# Altium project phancung1.PrjPcb
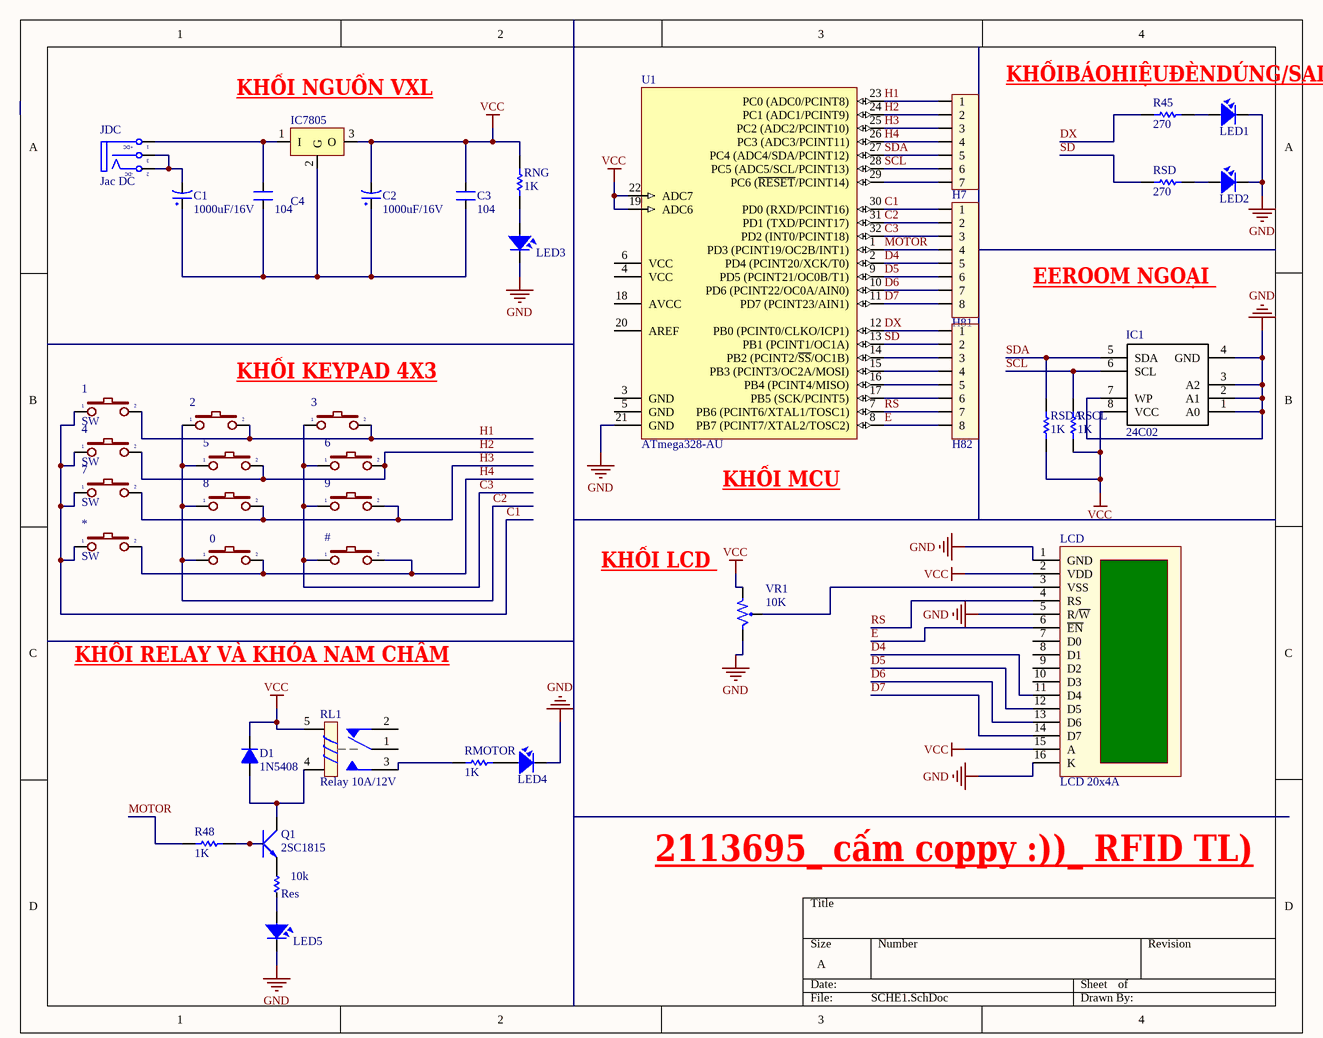
[diagram p0: SCHE1.SchDoc]
1 sheet, 41 parts. Net scope: global (net labels, ports and power ports of the same name join across sheets).
Board file: PCB1.PcbDoc

## Sheet SCHE1.SchDoc
size A; SheetNumber: 1; SheetTotal: 2

### Parts
0  (no value)  [SW1-SMD]
1  SW  [SW1-SMD]
2  (no value)  [SW1-SMD]
3  (no value)  [SW1-SMD]
4  SW  [SW1-SMD]
5  (no value)  [SW1-SMD]
6  (no value)  [SW1-SMD]
7  SW  [SW1-SMD]
8  (no value)  [SW1-SMD]
9  (no value)  [SW1-SMD]
10k  Res  [RES-1/2W]
#  (no value)  [SW1-SMD]
*  SW  [SW1-SMD]
C1  1000uF/16V  [CP1.5/3.4]
C2  1000uF/16V  [CP1.5/3.4]
C3  104  [CN2]
C4  104  [CN2]
D1  1N5408  [D5A]
H1  H7  [VH3.96M-7]
H2  H81  [VH3.96M-8]
H3  H82  [VH3.96M-8]
IC1  24C02  [DIP8]
IC7805  LM78xx  [TO220-123]  (value not drawn)
JDC  Jac DC  [DC-IN]
LCD  LCD 20x4A  [LCD20X4A]
LED1  LED  [LED-3MM-RED]  (value not drawn)
LED2  LED  [LED-3MM-RED]  (value not drawn)
LED3  LED  [LED-3]  (value not drawn)
LED4  LED  [LED-5-RED]  (value not drawn)
LED5  LED  [LED-3MM-GREEN]  (value not drawn)
Q1  2SC1815  [TO92-123]
R45  value 270  [R1/4W1]  (hidden comment: Res1)
R48  value 1K  [R1/4W]  (hidden comment: Res1)
RL1  Relay 10A/12V  [RELAY 5]
RMOTOR  value 1K  [R1/4W]  (hidden comment: Res1)
RNG  value 1K  [R1/4W]  (hidden comment: Res1)
RSCL  value 1K  [R1/4W]  (hidden comment: Res1)
RSD  value 270  [R1/4W1]  (hidden comment: Res1)
RSDA  value 1K  [R1/4W]  (hidden comment: Res1)
U1  ATmega328-AU  [TQFP32]
VR1  10K  [VR]

### Nets
GND: IC1.1(A0) IC1.2(A1) IC1.3(A2) IC1.4(GND) IC1.7(WP) LCD.1(GND) LCD.5(R/~{W}) LCD.16(K) LED1.2 LED2.2 LED3.2 LED4.2 LED5.2 U1.21(GND) VR1.3
VCC: C2.2 C3.2 D1.2(K) IC1.8(VCC) IC7805.3(O) LCD.2(VDD) LCD.15(A) RL1.5 RNG.2 RSCL.1 RSDA.1 U1.19(ADC6) U1.22(ADC7) VR1.1
C1: 1.1 4.1 7.1 *.1 H2.1 U1.30(PD0_(RXD/PCINT16))
C2: 0.1 2.1 5.1 8.1 H2.2 U1.31(PD1_(TXD/PCINT17))
C3: 3.1 6.1 9.1 #.1 H2.3 U1.32(PD2_(INT0/PCINT18))
D4: H2.5 LCD.11(D4) U1.2(PD4_(PCINT20/XCK/T0))
D5: H2.6 LCD.12(D5) U1.9(PD5_(PCINT21/OC0B/T1))
D6: H2.7 LCD.13(D6) U1.10(PD6_(PCINT22/OC0A/AIN0))
D7: H2.8 LCD.14(D7) U1.11(PD7_(PCINT23/AIN1))
DX: H3.1 R45.2 U1.12(PB0_(PCINT0/CLKO/ICP1))
E: H3.8 LCD.6(~{EN}) U1.8(PB7_(PCINT7/XTAL2/TOSC2))
H1: 1.2 2.2 3.2 H1.1 U1.23(PC0_(ADC0/PCINT8))
H2: 4.2 5.2 6.2 H1.2 U1.24(PC1_(ADC1/PCINT9))
H3: 7.2 8.2 9.2 H1.3 U1.25(PC2_(ADC2/PCINT10))
H4: 0.2 #.2 *.2 H1.4 U1.26(PC3_(ADC3/PCINT11))
MOTOR: H2.4 R48.2 U1.1(PD3_(PCINT19/OC2B/INT1))
RS: H3.7 LCD.4(RS) U1.7(PB6_(PCINT6/XTAL1/TOSC1))
SCL: H1.6 IC1.6(SCL) RSCL.2 U1.28(PC5_(ADC5/SCL/PCINT13))
SD: H3.2 RSD.2 U1.13(PB1_(PCINT1/OC1A))
SDA: H1.5 IC1.5(SDA) RSDA.2 U1.27(PC4_(ADC4/SDA/PCINT12))
Net10k_1: 10k.1 Q1.1(E)
Net10k_2: 10k.2 LED5.1
NetC1_1: C1.1 C2.1 C3.1 C4.1 IC7805.2(G)
NetC1_2: C1.2 JDC.2(TN) JDC.3(S)
NetC4_2: C4.2 IC7805.1(I) JDC.1(T)
NetD1_1: D1.1(A) Q1.2(C) RL1.4
NetH1_7: H1.7 U1.29(PC6_(~{RESET}/PCINT14))
NetH3_3: H3.3 U1.14(PB2_(PCINT2/~{SS}/OC1B))
NetH3_4: H3.4 U1.15(PB3_(PCINT3/OC2A/MOSI))
NetH3_5: H3.5 U1.16(PB4_(PCINT4/MISO))
NetH3_6: H3.6 U1.17(PB5_(SCK/PCINT5))
NetLCD_3: LCD.3(VSS) VR1.2
NetLED1_1: LED1.1 R45.1
NetLED2_1: LED2.1 RSD.1
NetLED3_1: LED3.1 RNG.1
NetLED4_1: LED4.1 RMOTOR.1
NetQ1_3: Q1.3(B) R48.1
NetRL1_3: RL1.3 RMOTOR.2

Not connected (* = marked no-connect by the designer): LCD 7(D0) 8(D1) 9(D2) 10(D3); RL1 1 2; U1 3(GND) 4(VCC) 5(GND) 6(VCC) 18(AVCC) 20(AREF)

### Notes on the sheet
- (near IC7805) KHỐI NGUỒN VXL
- KHỐIBÁOHIỆUĐÈNDÚNG/SAI
- EEROOM NGOẠI
- KHỐI KEYPAD 4X3
- (near U1) KHỐI MCU
- (near VR1) KHỐI LCD
- KHỐI RELAY VÀ KHÓA NAM CHÂM
- 2113695_ cấm coppy :))_ RFID TL)
- (in symbol DCIN) +DC; -DC

### Library data of the parts
0-9 # * = SW2: Switch button 2 pin; Value: SW chip 2 pin
10k = Res: Manufacturer: Generic Components; Class: Passive; SubClass: R; Published: 08/06/2000; Publisher: Altium Hobart Technology Centre
C1 C2 = CP4: Cap 1000uF/16V - 220uF/50V; Description 5: 4,7uF>10uF/250V_3,3uF>10uF/400V - 2,2uF>4,7uF/450V; Description 1: 2200uF-3300uF/6,3V - 1000uF-2200uF/10V; Description 2: 1000uF/16V - 470uF => 1000uF/25V - 100uF/100V; Description 3: 330uF>470uF/35V_220uF>470uF/50V_10uF>22uF/250V; Description 4: 220uF => 330uF/63V - 10uF =>33uF/160 - 200V; Value: 1000uF/16V
C3 C4 = CN2: Cap np 104 => 105pF; Value: 0.1uF
D1 = D5A: Diode 5A; Value: 1N5408
H1 = Header 7P VH3.96 Duc Thang: Cắm; Ten_Linh_Kien: Header 7P XH2.54-7P Đực Thẳng; Don_Vi: Con; Ma_Hang: MH003369; Chung_Loai: Cắm
H2 H3 = Header 8P VH3.96 Duc Thang: Cắm; Ten_Linh_Kien: Header 8P XH2.54-8P Đực Thẳng; Don_Vi: Con; Ma_Hang: MH003366; Chung_Loai: Cắm
IC1 = 24Cxx: Standard 2-Wire Bus Interface Serial EEPROM; Value: 24Cxx; Value: DIP 8; Copyright by: VanDungEvn
IC7805 = LM78xx: Positive Voltage Regulator; Note: Tab is connected to pin 3 (GND).; Published: 24-Aug-2001; LatestRevisionDate: 17-Jul-2002; LatestRevisionNote: Re-released for DXP Platform.; DatasheetVersion: Apr-1994; PackageVersion: Jul-1998; PackageReference: ISOWATT220AB; Publisher: Altium Limited; PackageDescription: TO, Thru-Hole, Vertical, Heatsink Mounted; 3 In-Line Leads; Pitch 2.54 mm; Pin sequence 1, 3, 2; ComponentLink1Description: Manufacturer Link; ComponentLink1URL: http://www.st.com/; ComponentLink2Description: Datasheet; ComponentLink2URL: http://www.st.com/stonline/products/literature/ds/2146/l78m05c.pdf
JDC = DCIN: Jac DC input; Value: Jac DC
LCD = LCD20x4A: LCD dipslay 20 char, 4 line; Value: Jum 40; Value: LCD 20x4A
LED1-LED5 = LED: LED Single colour Green and Red; Value: LED 3 ly Single Colour
Q1 = 2SC1815: NPN 600mW, ECB; Value: C1815
R45 RSD = Res1_2: Resistor; Manufacturer: Generic Components; Class: Passive; Published: 08/06/2000; Publisher: Altium Hobart Technology Centre; SubClass: Resistor
R48 RMOTOR RNG RSCL RSDA = Res1_1: Resistor; Manufacturer: Generic Components; Class: Passive; Published: 08/06/2000; Publisher: Altium Hobart Technology Centre; SubClass: Resistor
RL1 = Relay 5: Relay SPDT,10A - 12VDC 5 Pin; Value: Relay SPDT, 10A, 12V
U1 = ATmega328-AU: 8-bit AVR Microcontroller, 32KB Flash, 1KB EEPROM, 2KB SRAM, 32-pin TQFP, Industrial Grade (-40°C to 85°C); Published: 1-Apr-2010; DatasheetVersion: revA, Jan-2010; PackageVersion: revB, Oct-2001; PackageReference: 32A; Publisher: Altium Limited; PackageDescription: 32-Lead, 7x7x1.0 mm Body, 0.8mm Lead Pitch, Thin Profile Plastic Quad Flat Package (TQFP); Supplier 1: Digi-Key; Supplier Part Number 1: ATMEGA328-AU-ND; Supplier 2: Mouser; Supplier Part Number 2: 556-ATMEGA328-AU; Code_JEDEC: MS-026-ABA; ComponentLink1Description: Manufacturer Link; ComponentLink1URL: http://www.atmel.com/products/avr/default.asp?; ComponentLink2Description: ATmega48A/48PA/88A/88PA/168A/168PA/328/328P Datasheet; ComponentLink2URL: http://www.atmel.com/dyn/resources/prod_documents/8271.pdf; ComponentLink3Description: ATmega48A/48PA/88A/88PA/168A/168PA/328/328P Summary; ComponentLink3URL: http://www.atmel.com/dyn/resources/prod_documents/8271S.pdf; ComponentLink4Description: Atmel.com Home; ComponentLink4URL: http://www.atmel.com
VR1 = VR1: Var Resistor; Value: VR 10K